# Altium schematic sheet VI Sensors.SchDoc
size A4; SheetNumber: 11; SheetTotal: 11
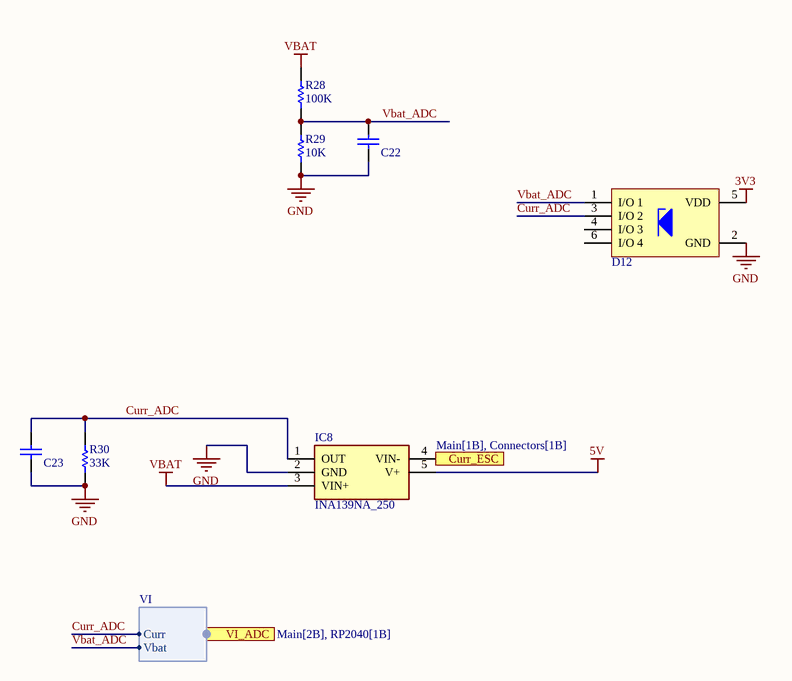
[diagram p0: VI Sensors.SchDoc]

## Parts
C22  1µF  [WCAP-CSGP_0603_L1.6W0.8H0.8_Reflow]  (value not drawn)
C23  1µF  [WCAP-CSGP_0603_L1.6W0.8H0.8_Reflow]  (value not drawn)
D12  3.3V  [WE-TVS_SOT23-6L]  (value not drawn)
IC8  INA139NA_250  [SOT95P280X145-5N]
R28  100K  [RESC0603(1608)_N]
R29  10K  [RESC0603(1608)_N]
R30  33K  [RESC0603(1608)_N]

## Ports
Curr_ESC (see Main[1B], Connectors[1B]), VI_ADC (harness VI, see Main[2B], RP2040[1B])

## Harnesses
VI: Curr, Vbat

## Nets
3V3: D12.5(VDD)
5V: IC8.5(V+)
GND: C22.1 C23.1 D12.2(GND) IC8.2(GND) R29.1 R30.1
VBAT: IC8.3(VIN+) R28.2
Curr_ADC: C23.2 D12.3(I/O_2) IC8.1(OUT) R30.2 ; port VI_ADC.Curr
Curr_ESC: IC8.4(VIN-) ; port Curr_ESC
Vbat_ADC: C22.2 D12.1(I/O_1) R28.1 R29.2 ; port VI_ADC.Vbat

Not connected (* = marked no-connect by the designer): D12 4(I/O_3) 6(I/O_4)

## Library data of the parts
C22 C23 = 885012106017: WCAP-CSGP Multilayer Ceramic Chip Capacitor, General Purpose, size 0603, X5R, 1µF, 16VDC; Manufacturer: Wurth Elektronik; Case/Size Code: 0603; Capacitance Tolerance: +/-20%; Dissipation Factor: 10%; Insulation Resistance: 0.1GΩ; Rated Voltage (DC): 16V; Technical Reference: X5R0603105M016DFCT10000; ComponentLink1Description: Website Link; ComponentLink1URL: https://www.we-online.com/redexpert/article/885012106017?ad; ComponentLink2Description: Datasheet Link; ComponentLink2URL: https://www.we-online.com/redexpert/spec/885012106017?ad; Manufacturer Part Number: 885012106017; Category: Multilayer Ceramic Chip Capacitors; Match Code: WCAP-CSGP; Mount: Surface Mount; Operating Temperature Max: 85°C; Operating Temperature Min: -55°C; Packaging: Tape and Reel; Length: 1.6mm; Width: 0.8mm; Height: 0.8mm; Capacitance: 1µF; Ceramic Type: X5R
D12 = 824015043: Shenzhen JingYang TT0514VL; Manufacturer: Wurth Elektronik; Match Code: WE-TVS; Case/Size Code: SOT23-6L; Channel ESD Clamping Voltage: 7.5V; Channel Input Capacitance: 2pF; Channel Reverse Leakage Current: 1µA; ESD Air Discharge Capability: 30kV; Number of Channels: 4+1; Polarity: Unidirectional; (Reverse) Breakdown Voltage: 4.5V; (Reverse) Peak Pulse Current: 30A; ComponentLink1Description: Website Link; ComponentLink1URL: https://www.we-online.com/redexpert/article/824015043?ad; ComponentLink2Description: Datasheet Link; ComponentLink2URL: https://www.we-online.com/redexpert/spec/824015043?ad; Manufacturer Part Number: 824015043; Category: ESD Protection; Mount: Surface Mount; Operating Temperature Max: 125°C; Operating Temperature Min: -55°C; Packaging: Tape and Reel; Length: 2.9mm; Width: 2.8mm; Height: 1.45mm; Channel Operating Voltage: 3.3V; ESD Contact Discharge Capability: 30kV
IC8 = INA139NA_250: Integrated Circuit; Manufacturer_Name: Texas Instruments; Manufacturer_Part_Number: INA139NA/250; Datasheet Link: http://www.ti.com/lit/ds/symlink/ina139.pdf; Height: 1.45mm; Mouser Part Number: 595-INA139NA/250; Mouser Price/Stock: https://www.mouser.co.uk/ProductDetail/Texas-Instruments/INA139NA-250?qs=VBduBm9rCJQSYOixXF05Zw%3D%3D; Arrow Part Number: INA139NA/250; Arrow Price/Stock: https://www.arrow.com/en/products/ina139na250/texas-instruments?region=nac
R28 = Res 100K: Chipwiderstand, SMD, Baureihe MC, 1%; Manufacturer: Multicomp; PackageReference: 0603; Value: 100K; OC_FARNELL: 9330402
R29 = Res 10K: Chipwiderstand, SMD, Baureihe MC, 1%; Manufacturer: Multicomp; PackageReference: 0603; Value: 10K; OC_FARNELL: 9330399
R30 = Res 33K: Chipwiderstand, SMD, Baureihe MC, 1%; Manufacturer: Multicomp; Value: 750R; PackageReference: 0603; OC_FARNELL: 9331506